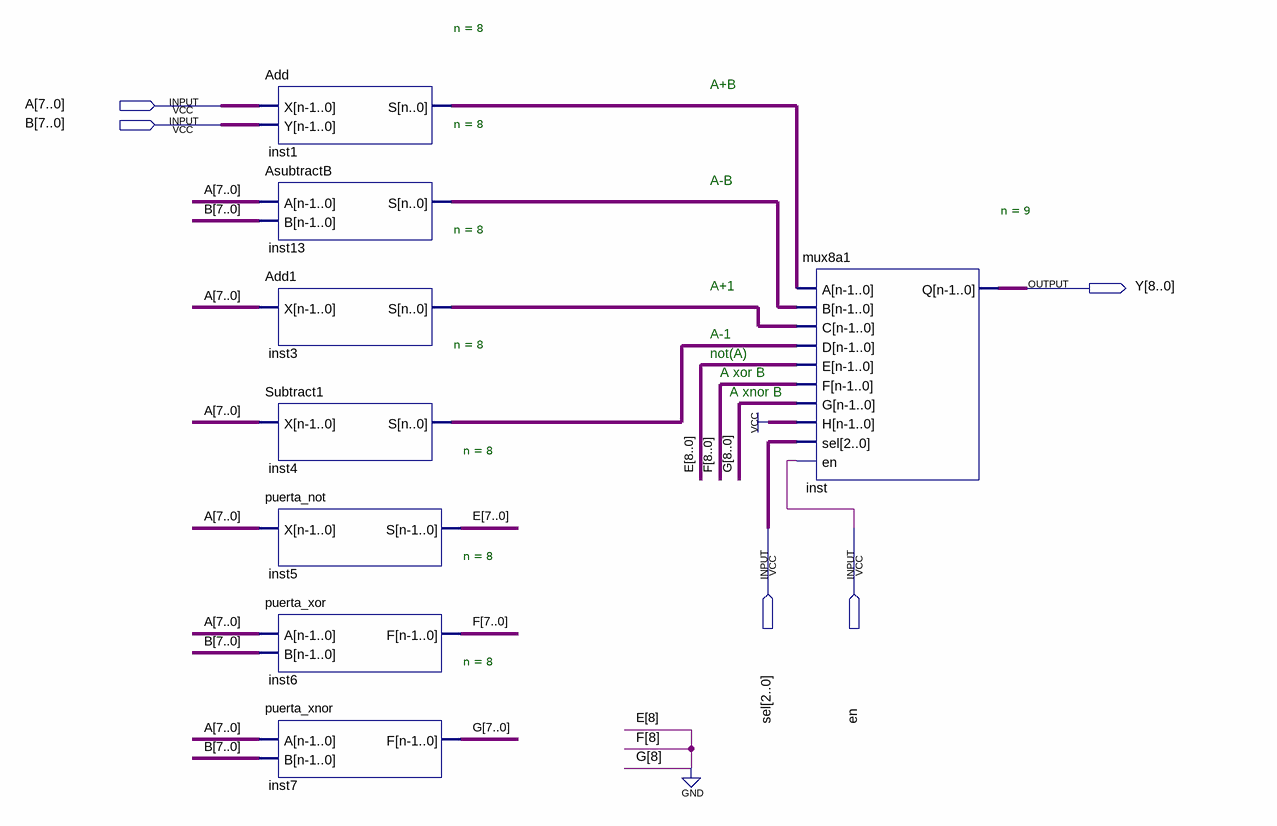
[diagram p0: schematic sheet]
// Quartus schematic AluModular.bdf as structural Verilog: 8 symbols, 5 pins
module AluModular (
  input  [7:0] A,
  input  [7:0] B,
  input  [2:0] sel,
  input  en,
  output [8:0] Y
);

  wire [7:0] E, F, G;
  wire [8:0] inst1_s, inst3_s, inst4_s, inst13_s;

  Add #(.n(8)) inst1 (.X(A), .Y(B), .S(inst1_s));
  AsubtractB #(.n(8)) inst13 (.A(A), .B(B), .S(inst13_s));
  Add1 #(.n(8)) inst3 (.X(A), .S(inst3_s));
  Subtract1 #(.n(8)) inst4 (.X(A), .S(inst4_s));
  puerta_not #(.n(8)) inst5 (.X(A), .S(E));
  puerta_xor #(.n(8)) inst6 (.A(A), .B(B), .F(F));
  puerta_xnor #(.n(8)) inst7 (.A(A), .B(B), .F(G));
  mux8a1 #(.n(9)) inst (
    .A(inst1_s), .B(inst13_s), .C(inst3_s), .D(inst4_s), .E({1'b0, E}), .F({1'b0, F}), .G({1'b0, G}),
    .H({9{1'b1}}), .sel(sel), .en(en), .Q(Y));

  // Notes on the sheet:
  //   A+B
  //   A-B
  //   A+1
  //   A-1
  //   not(A)
  //   A xor B
  //   A xnor B
endmodule
